# EAGLE design shield (EAGLE 6.3)
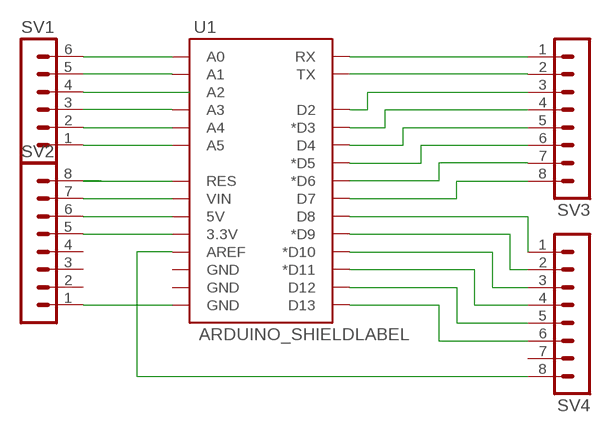
[diagram p0: schematic, sheet 1]

## Parts
SV1  MA06-1  [MA06-1]
SV2  MA08-1  [MA08-1]
SV3  MA08-1  [MA08-1]
SV4  MA08-1  [MA08-1]
U1  ARDUINO_SHIELDLABEL  [DUEMILANOVE_SHIELD]

## Nets
N$1: SV1.6 U1.A0
N$2: SV1.5 U1.A1
N$3: SV1.4
N$4: SV1.3 U1.A3
N$5: SV1.2 U1.A4
N$6: SV1.1 U1.A5
N$7: SV2.8 U1.RES
N$8: SV2.7 U1.VIN
N$9: SV2.6 U1.5V
N$10: SV2.5 U1.3.3V
N$11: SV3.1 U1.RX
N$12: SV3.2 U1.TX
N$13: SV2.1 U1.GND@0(GND)
N$15: SV3.3 U1.D2
N$16: SV3.4 U1.D3(*D3)
N$17: SV3.5 U1.D4
N$18: SV3.6 U1.D5(*D5)
N$19: SV3.7 U1.D6(*D6)
N$20: SV3.8 U1.D7
N$21: SV4.1 U1.D8
N$22: SV4.2 U1.D9(*D9)
N$23: SV4.3 U1.D10(*D10)
N$24: SV4.4 U1.D11(*D11)
N$25: SV4.5 U1.D12
N$26: SV4.6 U1.D13
N$28: SV4.8 U1.AREF
Unconnected: SV2.2 SV2.3 SV2.4 SV4.7 U1.A2 U1.GND@1(GND) U1.GND@2(GND)

## Library data of the parts
SV1 = con-lstb:MA06-1: PIN HEADER; OC_FARNELL: unknown; OC_NEWARK: unknown
SV2-SV4 = con-lstb:MA08-1: PIN HEADER; OC_FARNELL: unknown; OC_NEWARK: unknown
U1 = SparkFun-Boards:ARDUINO_SHIELD: Arduino shield footprint

## Board
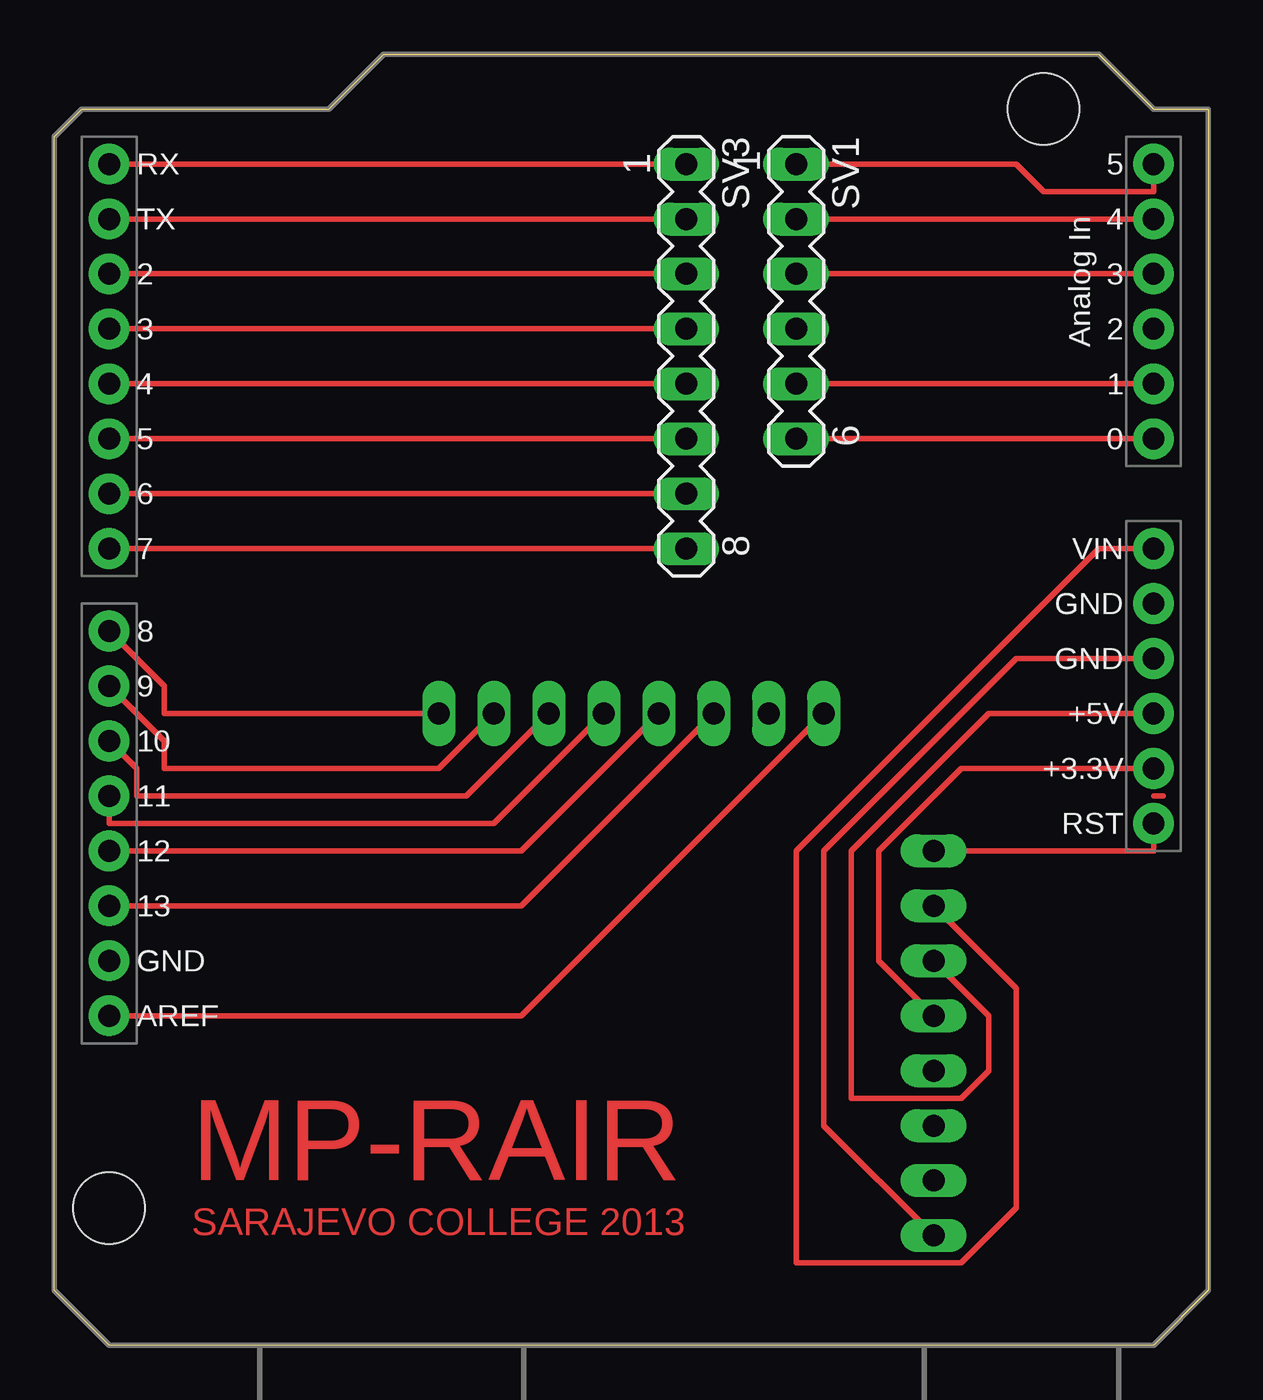
[diagram p1: board, top side]
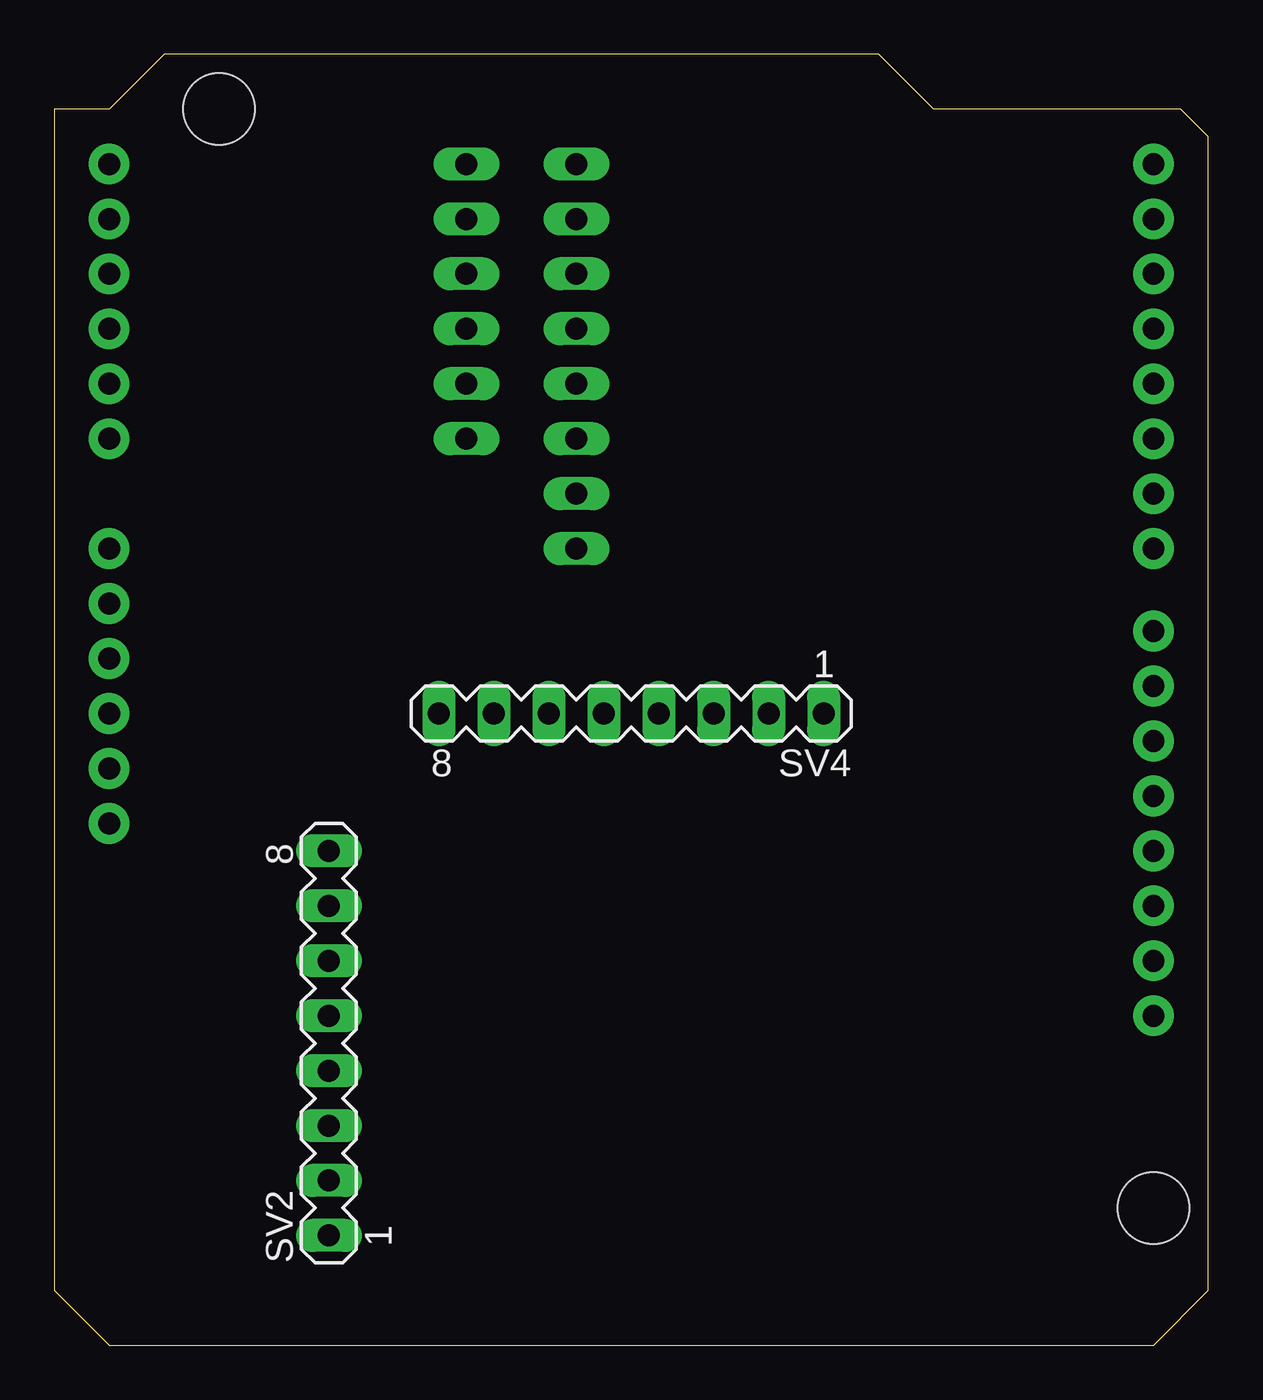
[diagram p2: board, bottom side, seen from below]

Size 53.34 x 59.69 mm. Coordinates in mm from the lower left corner, seen from the top.
Outline: 53.34,2.54 50.8,0 2.54,0 0,2.54 0,55.88 1.27,57.15 12.7,57.15 15.24,59.69 48.26,59.69 50.8,57.15 53.34,57.15 53.34,2.54
Copper layers (1*16): Top 0.035mm / dielectric 1.5mm / Bottom 0.035mm
Design rules "default *": minimum track width 10mil, minimum drill 24mil, track to track 10mil, track to pad 10mil, pad to pad 10mil, via to via 10mil, smd to smd 10mil, copper to edge 50mil, drill to drill 10mil, minimum pad ring 10mil, minimum via ring 8mil, stop-mask expansion 10mil, vias tented up to drill 0mil, thermal gap 10mil

### Footprints (pad centres in the part's own frame; a part is rotated, then mirrored left to right if it is on the bottom)
MA06-1 = drill 1.016 long: 1 -6.35,0; 2 -3.81,0; 3 -1.27,0; 4 1.27,0; 5 3.81,0; 6 6.35,0
MA08-1 = drill 1.016 long: 1 -8.89,0; 2 -6.35,0; 3 -3.81,0; 4 -1.27,0; 5 1.27,0; 6 3.81,0; 7 6.35,0; 8 8.89,0
DUEMILANOVE_SHIELD = drill 1.016 pad 1.88: 3.3V 50.8,26.67; 5V 50.8,29.21; A0 50.8,41.91; A1 50.8,44.45; A2 50.8,46.99; A3 50.8,49.53; A4 50.8,52.07; A5 50.8,54.61; AREF 2.54,15.24; D2 2.54,49.53; D3 2.54,46.99; D4 2.54,44.45; D5 2.54,41.91; D6 2.54,39.37; D7 2.54,36.83; D8 2.54,33.02; D9 2.54,30.48; D10 2.54,27.94; D11 2.54,25.4; D12 2.54,22.86; D13 2.54,20.32; GND@0 50.8,31.75; GND@1 50.8,34.29; GND@2 2.54,17.78; RES 50.8,24.13; RX 2.54,54.61; TX 2.54,52.07; VIN 50.8,36.83 | hole 3.302: 45.72,57.15; 2.54,6.35

### Placement (x,y rotation side)
SV1  34.29,48.26 270 top
SV2  40.64,13.97 90 bottom
SV3  29.21,45.72 270 top
SV4  26.67,29.21 180 bottom
U1  0,0 0 top

### Tracks (layer width: path | path; a pad name or v marks a point on that pad's centre or on a via)
N$1
  Top 0.254: U1.A0 SV1.6
N$2
  Top 0.254: U1.A1 SV1.5
N$4
  Top 0.254: U1.A3 SV1.3
N$5
  Top 0.254: U1.A4 SV1.2
N$6
  Top 0.254: SV1.1 44.45,54.61 45.72,53.34 50.8,53.34 U1.A5
N$7
  Top 0.254: SV2.8 50.8,22.86 U1.RES
N$8
  Top 0.254: SV2.7 44.45,16.51 44.45,6.35 41.91,3.81 34.29,3.81 34.29,22.86 48.26,36.83 U1.VIN
N$9
  Top 0.254: SV2.6 43.18,15.24 43.18,12.7 41.91,11.43 36.83,11.43 36.83,22.86 43.18,29.21 U1.5V
N$10
  Top 0.254: SV2.5 38.1,17.78 38.1,22.86 41.91,26.67 U1.3.3V
N$11
  Top 0.254: U1.RX SV3.1
N$12
  Top 0.254: U1.TX SV3.2
N$13
  Top 0.254: SV2.1 35.56,10.16 35.56,22.86 44.45,31.75 U1.GND@0
N$14
  Top 0.254: 50.8,25.4 51.25,25.4
N$15
  Top 0.254: U1.D2 SV3.3
N$16
  Top 0.254: U1.D3 SV3.4
N$17
  Top 0.254: U1.D4 SV3.5
N$18
  Top 0.254: U1.D5 SV3.6
N$19
  Top 0.254: U1.D6 SV3.7
N$20
  Top 0.254: U1.D7 SV3.8
N$21
  Top 0.254: SV4.1 5.08,29.21 5.08,30.48 U1.D8
N$22
  Top 0.254: SV4.2 17.78,26.67 5.08,26.67 5.08,27.94 U1.D9
N$23
  Top 0.254: SV4.3 19.05,25.4 3.81,25.4 3.81,26.67 U1.D10
N$24
  Top 0.254: SV4.4 20.32,24.13 2.54,24.13 U1.D11
N$25
  Top 0.254: SV4.5 21.59,22.86 U1.D12
N$26
  Top 0.254: SV4.6 21.59,20.32 U1.D13
N$28
  Top 0.254: SV4.8 21.59,15.24 U1.AREF

### Text on the board
Top: MP-RAIR | SARAJEVO COLLEGE 2013